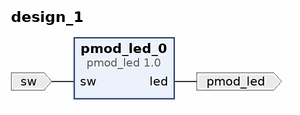
[diagram p0: block diagram of the top level]
# Vivado block design design_1, xc7z010clg400-1, Vivado 2021.2
create_bd_design design_1

create_bd_port -dir I -type data sw
create_bd_port -dir O -type data pmod_led

create_bd_cell -type ip -vlnv xilinx.com:hls:pmod_led:1.0 pmod_led_0

# ---- connections ----

connect_bd_net [get_bd_pins pmod_led_0/led] [get_bd_ports pmod_led]
connect_bd_net -net sw_0_1 [get_bd_ports sw] [get_bd_pins pmod_led_0/sw]

validate_bd_design
save_bd_design
